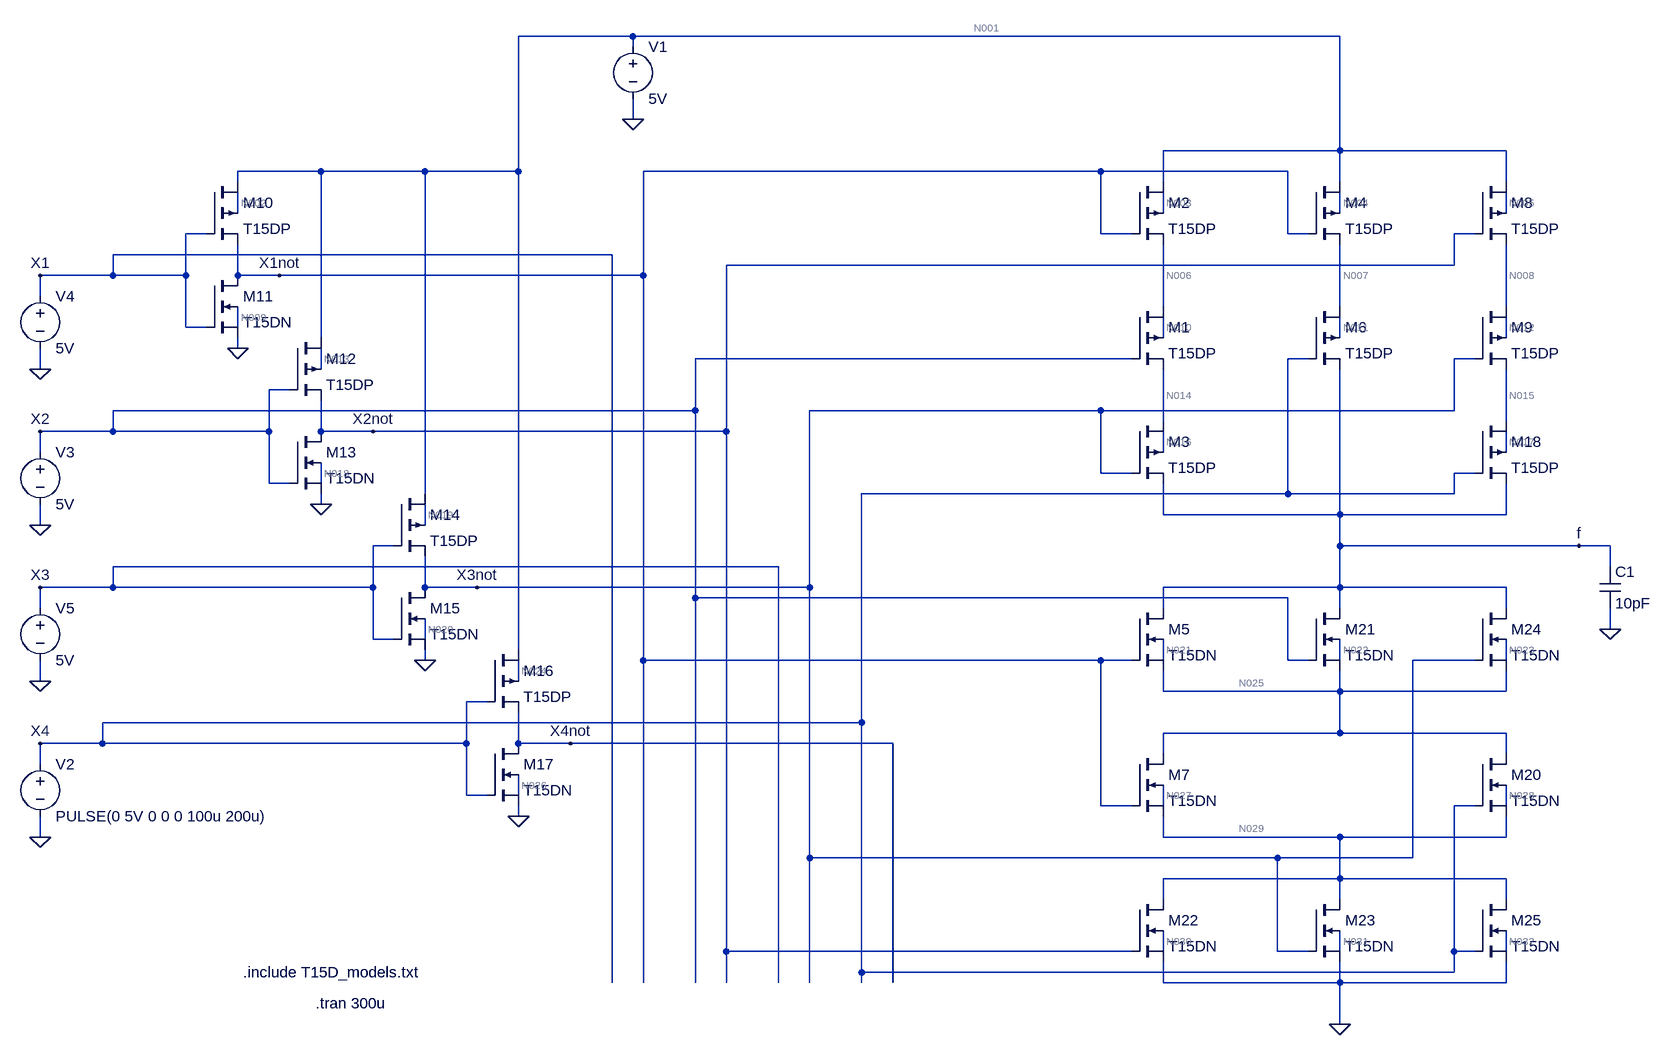
[diagram p0: schematic ehb322e_hw2.asc]
ehb322e_hw2.asc, the LTspice schematic file:
Version 4
SHEET 1 1388 696
WIRE -192 -944 -368 -944
WIRE 896 -944 -192 -944
WIRE -192 -928 -192 -944
WIRE -192 -816 -192 -848
WIRE 896 -768 896 -944
WIRE 896 -768 624 -768
WIRE 1152 -768 896 -768
WIRE -672 -736 -800 -736
WIRE -512 -736 -672 -736
WIRE -368 -736 -368 -944
WIRE -368 -736 -512 -736
WIRE 528 -736 -176 -736
WIRE 816 -736 528 -736
WIRE -800 -720 -800 -736
WIRE 624 -720 624 -768
WIRE 896 -720 896 -768
WIRE 1152 -720 1152 -768
WIRE -800 -672 -800 -704
WIRE 624 -672 624 -704
WIRE 896 -672 896 -704
WIRE 1152 -672 1152 -704
WIRE -848 -640 -880 -640
WIRE 528 -640 528 -736
WIRE 576 -640 528 -640
WIRE 816 -640 816 -736
WIRE 848 -640 816 -640
WIRE 1104 -640 1072 -640
WIRE -224 -608 -992 -608
WIRE 1072 -592 1072 -640
WIRE 1072 -592 -48 -592
WIRE -992 -576 -992 -608
WIRE -992 -576 -1104 -576
WIRE -880 -576 -880 -640
WIRE -880 -576 -992 -576
WIRE -800 -576 -800 -624
WIRE -736 -576 -800 -576
WIRE -176 -576 -176 -736
WIRE -176 -576 -736 -576
WIRE -1104 -544 -1104 -576
WIRE 624 -528 624 -624
WIRE 896 -528 896 -624
WIRE 1152 -528 1152 -624
WIRE -880 -496 -880 -576
WIRE -848 -496 -880 -496
WIRE -800 -496 -800 -528
WIRE -672 -480 -672 -736
WIRE 624 -480 624 -512
WIRE 896 -480 896 -512
WIRE 1152 -480 1152 -512
WIRE -800 -464 -800 -480
WIRE 576 -448 -96 -448
WIRE 848 -448 816 -448
WIRE 1104 -448 1072 -448
WIRE -1104 -432 -1104 -464
WIRE -672 -432 -672 -464
WIRE -720 -400 -752 -400
WIRE -96 -368 -96 -448
WIRE -96 -368 -992 -368
WIRE 528 -368 80 -368
WIRE 1072 -368 1072 -448
WIRE 1072 -368 528 -368
WIRE 624 -352 624 -432
WIRE 1152 -352 1152 -432
WIRE -992 -336 -992 -368
WIRE -992 -336 -1104 -336
WIRE -752 -336 -752 -400
WIRE -752 -336 -992 -336
WIRE -672 -336 -672 -384
WIRE -592 -336 -672 -336
WIRE -48 -336 -48 -592
WIRE -48 -336 -592 -336
WIRE -1104 -304 -1104 -336
WIRE 624 -304 624 -336
WIRE 1152 -304 1152 -336
WIRE 528 -272 528 -368
WIRE 576 -272 528 -272
WIRE 1104 -272 1072 -272
WIRE -752 -256 -752 -336
WIRE -720 -256 -752 -256
WIRE -672 -256 -672 -288
WIRE -512 -240 -512 -736
WIRE 816 -240 816 -448
WIRE 816 -240 160 -240
WIRE 1072 -240 1072 -272
WIRE 1072 -240 816 -240
WIRE -672 -224 -672 -240
WIRE 624 -208 624 -256
WIRE 896 -208 896 -432
WIRE 896 -208 624 -208
WIRE 1152 -208 1152 -256
WIRE 1152 -208 896 -208
WIRE -1104 -192 -1104 -224
WIRE -512 -192 -512 -224
WIRE -560 -160 -592 -160
WIRE 896 -160 896 -208
WIRE 1264 -160 896 -160
WIRE 1312 -160 1264 -160
WIRE 32 -128 -992 -128
WIRE 1312 -128 1312 -160
WIRE -992 -96 -992 -128
WIRE -992 -96 -1104 -96
WIRE -592 -96 -592 -160
WIRE -592 -96 -992 -96
WIRE -512 -96 -512 -144
WIRE -432 -96 -512 -96
WIRE 80 -96 80 -368
WIRE 80 -96 -432 -96
WIRE 896 -96 896 -160
WIRE 896 -96 624 -96
WIRE 1152 -96 896 -96
WIRE -96 -80 -96 -368
WIRE 816 -80 -96 -80
WIRE -1104 -64 -1104 -96
WIRE 624 -64 624 -96
WIRE 896 -64 896 -96
WIRE 1152 -64 1152 -96
WIRE 1312 -32 1312 -64
WIRE -592 -16 -592 -96
WIRE -560 -16 -592 -16
WIRE -512 -16 -512 -48
WIRE -368 0 -368 -736
WIRE -512 16 -512 0
WIRE -176 16 -176 -576
WIRE 528 16 -176 16
WIRE 576 16 528 16
WIRE 624 16 624 -16
WIRE 816 16 816 -80
WIRE 848 16 816 16
WIRE 896 16 896 -16
WIRE 1104 16 1008 16
WIRE 1152 16 1152 -16
WIRE -1104 48 -1104 16
WIRE -368 48 -368 16
WIRE 624 64 624 32
WIRE 896 64 896 32
WIRE 896 64 624 64
WIRE 1152 64 1152 32
WIRE 1152 64 896 64
WIRE -416 80 -448 80
WIRE 160 112 160 -240
WIRE 160 112 -1008 112
WIRE 896 128 896 64
WIRE 896 128 624 128
WIRE 1152 128 896 128
WIRE -1008 144 -1008 112
WIRE -1008 144 -1104 144
WIRE -448 144 -448 80
WIRE -448 144 -1008 144
WIRE -368 144 -368 96
WIRE -288 144 -368 144
WIRE 208 144 -288 144
WIRE 624 160 624 128
WIRE 1152 160 1152 128
WIRE -1104 176 -1104 144
WIRE -448 224 -448 144
WIRE -416 224 -448 224
WIRE -368 224 -368 192
WIRE 528 240 528 16
WIRE 576 240 528 240
WIRE 624 240 624 208
WIRE 1104 240 1072 240
WIRE 1152 240 1152 208
WIRE -368 256 -368 240
WIRE -1104 288 -1104 256
WIRE 624 288 624 256
WIRE 896 288 624 288
WIRE 1152 288 1152 256
WIRE 1152 288 896 288
WIRE 80 320 80 -96
WIRE 800 320 80 320
WIRE 1008 320 1008 16
WIRE 1008 320 800 320
WIRE 896 352 896 288
WIRE 896 352 624 352
WIRE 1152 352 896 352
WIRE 624 384 624 352
WIRE 896 384 896 352
WIRE 1152 384 1152 352
WIRE -48 464 -48 -336
WIRE 576 464 -48 464
WIRE 624 464 624 432
WIRE 800 464 800 320
WIRE 848 464 800 464
WIRE 896 464 896 432
WIRE 1072 464 1072 240
WIRE 1104 464 1072 464
WIRE 1152 464 1152 432
WIRE 160 496 160 112
WIRE 1072 496 1072 464
WIRE 1072 496 160 496
WIRE -224 512 -224 -608
WIRE -176 512 -176 16
WIRE -96 512 -96 -80
WIRE -48 512 -48 464
WIRE 32 512 32 -128
WIRE 80 512 80 320
WIRE 160 512 160 496
WIRE 208 512 208 144
WIRE 624 512 624 480
WIRE 896 512 896 480
WIRE 896 512 624 512
WIRE 1152 512 1152 480
WIRE 1152 512 896 512
WIRE 896 576 896 512
FLAG -368 256 0
FLAG -512 16 0
FLAG -672 -224 0
FLAG -800 -464 0
FLAG -192 -816 0
FLAG 1264 -160 f
FLAG -736 -576 X1not
FLAG -592 -336 X2not
FLAG -432 -96 X3not
FLAG -288 144 X4not
FLAG 896 576 0
FLAG -1104 288 0
FLAG 1312 -32 0
FLAG -1104 -432 0
FLAG -1104 -576 X1
FLAG -1104 -336 X2
FLAG -1104 -96 X3
FLAG -1104 144 X4
FLAG -1104 -192 0
FLAG -1104 48 0
SYMBOL pmos4 576 -720 R0
SYMATTR InstName M2
SYMATTR Value T15DP
SYMATTR Value2 l=1u w=2u
SYMBOL voltage -192 -944 R0
WINDOW 123 0 0 Left 2
WINDOW 39 0 0 Left 2
SYMATTR InstName V1
SYMATTR Value 5V
SYMBOL nmos4 576 -64 R0
SYMATTR InstName M5
SYMATTR Value T15DN
SYMATTR Value2 l=1u w=1u
SYMBOL pmos4 -848 -720 R0
SYMATTR InstName M10
SYMATTR Value T15DP
SYMATTR Value2 l=1u w=2u
SYMBOL nmos4 -848 -576 R0
SYMATTR InstName M11
SYMATTR Value T15DN
SYMATTR Value2 l=1u w=1u
SYMBOL pmos4 -720 -480 R0
SYMATTR InstName M12
SYMATTR Value T15DP
SYMATTR Value2 l=1u w=2u
SYMBOL nmos4 -720 -336 R0
SYMATTR InstName M13
SYMATTR Value T15DN
SYMATTR Value2 l=1u w=1u
SYMBOL pmos4 -560 -240 R0
SYMATTR InstName M14
SYMATTR Value T15DP
SYMATTR Value2 l=1u w=2u
SYMBOL nmos4 -560 -96 R0
SYMATTR InstName M15
SYMATTR Value T15DN
SYMATTR Value2 l=1u w=1u
SYMBOL pmos4 -416 0 R0
SYMATTR InstName M16
SYMATTR Value T15DP
SYMATTR Value2 l=1u w=2u
SYMBOL nmos4 -416 144 R0
SYMATTR InstName M17
SYMATTR Value T15DN
SYMATTR Value2 l=1u w=1u
SYMBOL pmos4 576 -528 R0
SYMATTR InstName M1
SYMATTR Value T15DP
SYMATTR Value2 l=1u w=2u
SYMBOL pmos4 576 -352 R0
SYMATTR InstName M3
SYMATTR Value T15DP
SYMATTR Value2 l=1u w=2u
SYMBOL pmos4 848 -720 R0
SYMATTR InstName M4
SYMATTR Value T15DP
SYMATTR Value2 l=1u w=2u
SYMBOL pmos4 848 -528 R0
SYMATTR InstName M6
SYMATTR Value T15DP
SYMATTR Value2 l=1u w=2u
SYMBOL pmos4 1104 -720 R0
SYMATTR InstName M8
SYMATTR Value T15DP
SYMATTR Value2 l=1u w=2u
SYMBOL pmos4 1104 -528 R0
SYMATTR InstName M9
SYMATTR Value T15DP
SYMATTR Value2 l=1u w=2u
SYMBOL pmos4 1104 -352 R0
SYMATTR InstName M18
SYMATTR Value T15DP
SYMATTR Value2 l=1u w=2u
SYMBOL nmos4 848 -64 R0
SYMATTR InstName M21
SYMATTR Value T15DN
SYMATTR Value2 l=1u w=1u
SYMBOL nmos4 1104 -64 R0
SYMATTR InstName M24
SYMATTR Value T15DN
SYMATTR Value2 l=1u w=1u
SYMBOL nmos4 576 160 R0
SYMATTR InstName M7
SYMATTR Value T15DN
SYMATTR Value2 l=1u w=1u
SYMBOL nmos4 1104 160 R0
SYMATTR InstName M20
SYMATTR Value T15DN
SYMATTR Value2 l=1u w=1u
SYMBOL nmos4 576 384 R0
SYMATTR InstName M22
SYMATTR Value T15DN
SYMATTR Value2 l=1u w=1u
SYMBOL nmos4 848 384 R0
SYMATTR InstName M23
SYMATTR Value T15DN
SYMATTR Value2 l=1u w=1u
SYMBOL nmos4 1104 384 R0
SYMATTR InstName M25
SYMATTR Value T15DN
SYMATTR Value2 l=1u w=1u
SYMBOL voltage -1104 160 R0
WINDOW 123 0 0 Left 2
WINDOW 39 0 0 Left 2
SYMATTR InstName V2
SYMATTR Value PULSE(0 5V 0 0 0 100u 200u)
SYMBOL cap 1296 -128 R0
SYMATTR InstName C1
SYMATTR Value 10pF
SYMBOL voltage -1104 -560 R0
WINDOW 123 0 0 Left 2
WINDOW 39 0 0 Left 2
SYMATTR InstName V4
SYMATTR Value 5V
SYMBOL voltage -1104 -320 R0
WINDOW 123 0 0 Left 2
WINDOW 39 0 0 Left 2
SYMATTR InstName V3
SYMATTR Value 5V
SYMBOL voltage -1104 -80 R0
WINDOW 123 0 0 Left 2
WINDOW 39 0 0 Left 2
SYMATTR InstName V5
SYMATTR Value 5V
TEXT -792 496 Left 2 !.include T15D_models.txt
TEXT -680 544 Left 2 !.tran 300u

The netlist it stands for:
* ehb322e_hw2.asc
M2 N001 X1not N006 N003 T15DP l=1u w=2u
V1 N001 0 5V
M5 f X1not N025 N021 T15DN l=1u w=1u
M10 N001 X1 X1not N002 T15DP l=1u w=2u
M11 X1not X1 0 N009 T15DN l=1u w=1u
M12 N001 X2 X2not N013 T15DP l=1u w=2u
M13 X2not X2 0 N018 T15DN l=1u w=1u
M14 N001 X3 X3not N019 T15DP l=1u w=2u
M15 X3not X3 0 N020 T15DN l=1u w=1u
M16 N001 X4 X4not N024 T15DP l=1u w=2u
M17 X4not X4 0 N026 T15DN l=1u w=1u
M1 N006 X2 N014 N010 T15DP l=1u w=2u
M3 N014 X3not f N016 T15DP l=1u w=2u
M4 N001 X1not N007 N004 T15DP l=1u w=2u
M6 N007 X4 f N011 T15DP l=1u w=2u
M8 N001 X2not N008 N005 T15DP l=1u w=2u
M9 N008 X3not N015 N012 T15DP l=1u w=2u
M18 N015 X4 f N017 T15DP l=1u w=2u
M21 f X2 N025 N022 T15DN l=1u w=1u
M24 f X3not N025 N023 T15DN l=1u w=1u
M7 N025 X1not N029 N027 T15DN l=1u w=1u
M20 N025 X4 N029 N028 T15DN l=1u w=1u
M22 N029 X2not 0 N030 T15DN l=1u w=1u
M23 N029 X3not 0 N031 T15DN l=1u w=1u
M25 N029 X4 0 N032 T15DN l=1u w=1u
V2 X4 0 PULSE(0 5V 0 0 0 100u 200u)
C1 f 0 10pF
V4 X1 0 5V
V3 X2 0 5V
V5 X3 0 5V
.model NMOS NMOS
.model PMOS PMOS
.lib standard.mos
.include T15D_models.txt
.tran 300u
.backanno
.end

* Results of the author's LTspice run, read from the files saved beside the schematic
* Operating Point, zero values left out:
*   V(n001) = 5 V
*   V(x1not) = 48.67 mV
*   V(n006) = 4.999 V
*   V(n003) = 4.999 V
*   V(f) = 4.915 V
*   V(n025) = 3.889 V
*   V(n021) = 4.319 V
*   V(x1) = 5 V
*   V(n002) = 4.488 V
*   V(n009) = 24.33 mV
*   V(x2) = 5 V
*   V(x2not) = 48.67 mV
*   V(n013) = 4.488 V
*   V(n018) = 24.33 mV
*   V(x3) = 5 V
*   V(x3not) = 48.67 mV
*   V(n019) = 4.488 V
*   V(n020) = 24.33 mV
*   V(x4not) = 4.918 V
*   V(n024) = 4.959 V
*   V(n026) = 511.6 mV
*   V(n014) = 4.916 V
*   V(n010) = 4.957 V
*   V(n016) = 4.915 V
*   V(n007) = 4.957 V
*   V(n004) = 4.979 V
*   V(n011) = 4.936 V
*   V(n008) = 4.972 V
*   V(n005) = 4.986 V
*   V(n015) = 4.943 V
*   V(n012) = 4.957 V
*   V(n017) = 4.929 V
*   V(n022) = 4.323 V
*   V(n023) = 4.319 V
*   V(n029) = 1.599 V
*   V(n027) = 2.083 V
*   V(n028) = 2.083 V
*   V(n030) = 466 mV
*   V(n031) = 466 mV
*   V(n032) = 466 mV
*   Id(M25) = 2.732 µA
*   Is(M25) = -2.732 µA
*   Id(M23) = 2.732 µA
*   Is(M23) = -2.732 µA
*   Id(M22) = 2.732 µA
*   Is(M22) = -2.732 µA
*   Id(M20) = 4.098 µA
*   Is(M20) = -4.098 µA
*   Id(M7) = 4.098 µA
*   Is(M7) = -4.098 µA
*   Id(M24) = 1.62 µA
*   Ib(M24) = 350.3 pA
*   Is(M24) = -1.621 µA
*   Id(M21) = 4.977 µA
*   Ib(M21) = 28.43 nA
*   Is(M21) = -5.005 µA
*   Id(M17) = 9.324 µA
*   Is(M17) = -9.324 µA
*   Id(M15) = 9.391 µA
*   Is(M15) = -9.391 µA
*   Id(M13) = 9.391 µA
*   Is(M13) = -9.391 µA
*   Id(M11) = 9.391 µA
*   Is(M11) = -9.391 µA
*   Id(M5) = 1.62 µA
*   Ib(M5) = 350.3 pA
*   Is(M5) = -1.621 µA
*   Id(M18) = 3.227 µA
*   Is(M18) = -3.227 µA
*   Id(M9) = 3.227 µA
*   Is(M9) = -3.227 µA
*   Id(M8) = 3.227 µA
*   Is(M8) = -3.227 µA
*   Id(M6) = 4.843 µA
*   Is(M6) = -4.843 µA
*   Id(M4) = 4.843 µA
*   Is(M4) = -4.843 µA
*   Id(M3) = 124.8 nA
*   Is(M3) = -124.8 nA
*   Id(M1) = 124.8 nA
*   Is(M1) = -124.8 nA
*   Id(M16) = 9.324 µA
*   Is(M16) = -9.324 µA
*   Id(M14) = 9.391 µA
*   Is(M14) = -9.391 µA
*   Id(M12) = 9.391 µA
*   Is(M12) = -9.391 µA
*   Id(M10) = 9.391 µA
*   Is(M10) = -9.391 µA
*   Id(M2) = 124.8 nA
*   Is(M2) = -124.8 nA
*   I(V1) = -45.69 µA
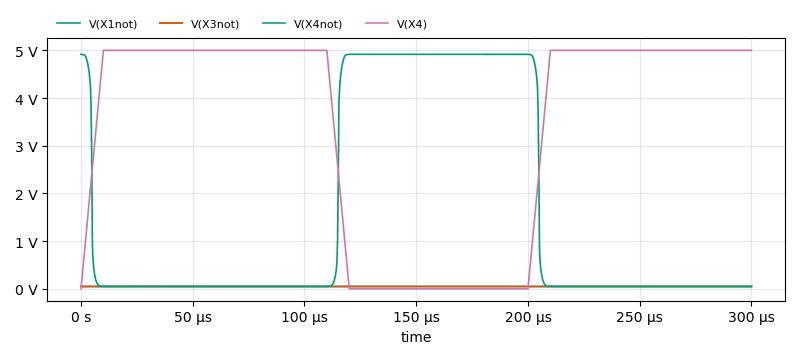
[diagram p1: Transient Analysis of ehb322e_hw2.asc, plotted from the saved traces]
* Transient Analysis, 1 run:
*   V(X1not): min 48.58 mV, max 48.71 mV, average 48.67 mV, rms 48.67 mV, last 48.67 mV
*   V(X3not): min 48.57 mV, max 48.78 mV, average 48.67 mV, rms 48.67 mV, last 48.67 mV
*   V(X4not): min 48.67 mV, max 4.918 V, average 1.581 V, rms 2.741 V, last 48.67 mV
*   V(X4): min 0 V, max 5 V, average 3.417 V, rms 4.083 V, last 5 V